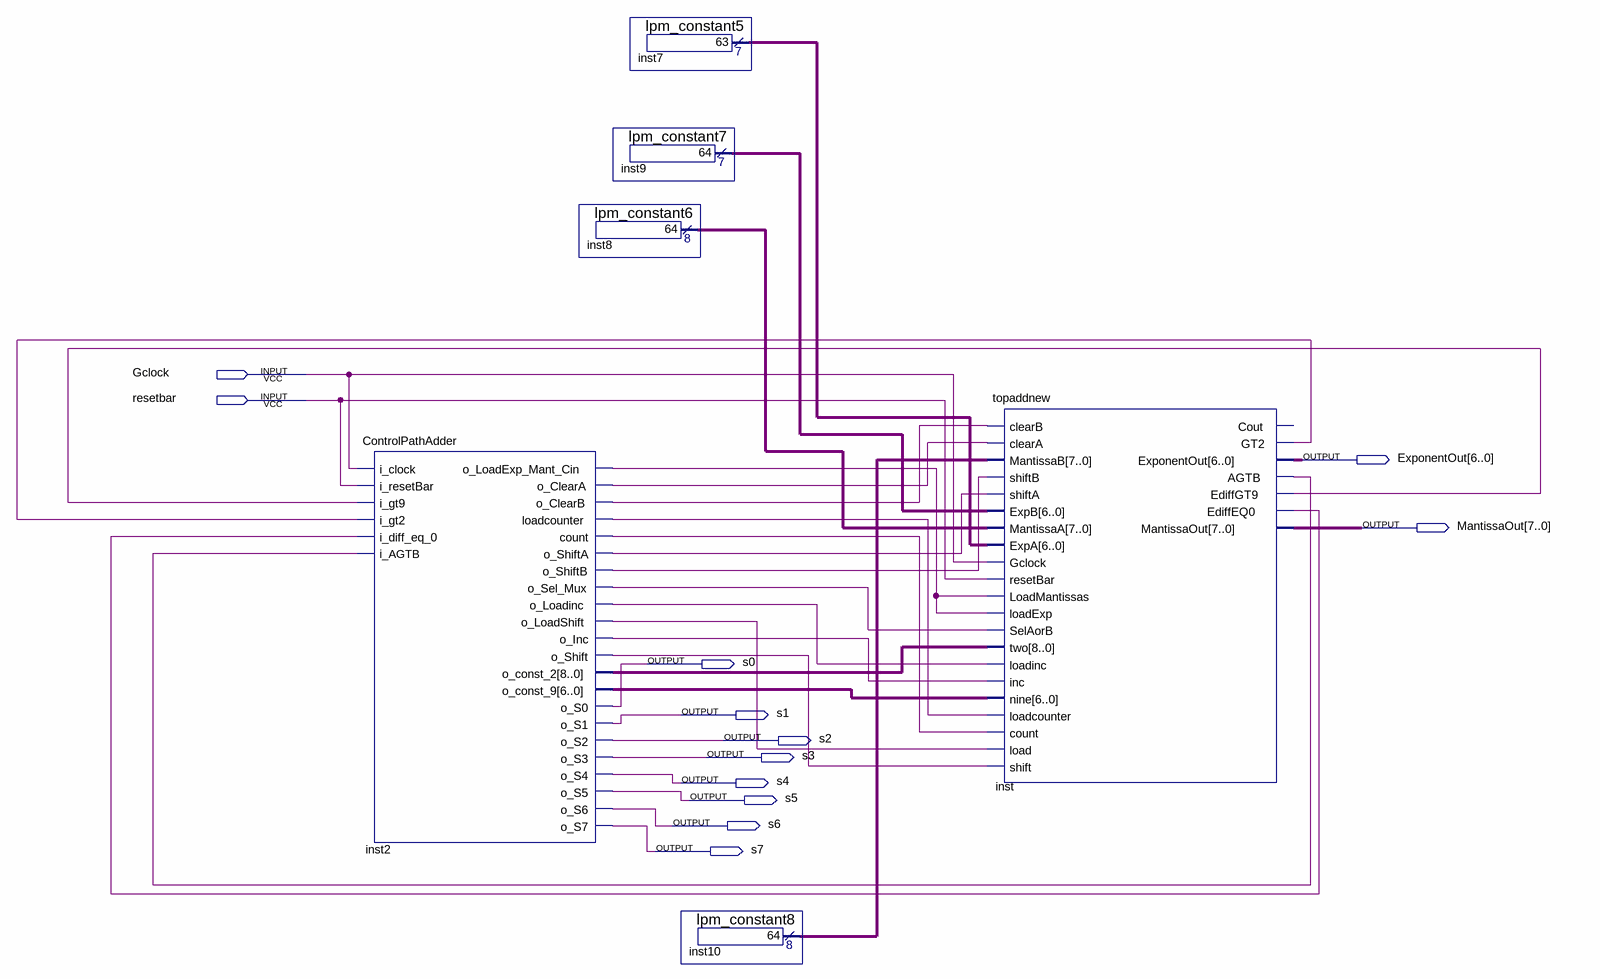
[diagram p0: schematic sheet]
// Quartus schematic adder.bdf as structural Verilog: 6 symbols, 12 pins
module adder (
  input  Gclock,
  input  resetbar,
  output [6:0] ExponentOut,
  output [7:0] MantissaOut,
  output s0,
  output s1,
  output s2,
  output s3,
  output s4,
  output s5,
  output s6,
  output s7
);

  wire inst2_count, inst2_loadcounter, inst2_o_cleara, inst2_o_clearb, inst2_o_inc, inst2_o_loadexp_mant_cin,
       inst2_o_loadinc, inst2_o_loadshift, inst2_o_sel_mux, inst2_o_shift, inst2_o_shifta, inst2_o_shiftb,
       inst_agtb, inst_ediffeq0, inst_ediffgt9, inst_gt2;
  wire [6:0] inst2_o_const_9, inst7_result, inst9_result;
  wire [7:0] inst8_result, inst10_result;
  wire [8:0] inst2_o_const_2;

  ControlPathAdder inst2 (
    .i_clock(Gclock), .i_resetBar(resetbar), .i_gt9(inst_ediffgt9), .i_gt2(inst_gt2),
    .i_diff_eq_0(inst_ediffeq0), .i_AGTB(inst_agtb), .o_LoadExp_Mant_Cin(inst2_o_loadexp_mant_cin),
    .o_ClearA(inst2_o_cleara), .o_ClearB(inst2_o_clearb), .loadcounter(inst2_loadcounter),
    .count(inst2_count), .o_ShiftA(inst2_o_shifta), .o_ShiftB(inst2_o_shiftb), .o_Sel_Mux(inst2_o_sel_mux),
    .o_Loadinc(inst2_o_loadinc), .o_LoadShift(inst2_o_loadshift), .o_Inc(inst2_o_inc),
    .o_Shift(inst2_o_shift), .o_const_2(inst2_o_const_2), .o_const_9(inst2_o_const_9), .o_S0(s0), .o_S1(s1),
    .o_S2(s2), .o_S3(s3), .o_S4(s4), .o_S5(s5), .o_S6(s6), .o_S7(s7));
  lpm_constant7 inst9 (.result(inst9_result));
  lpm_constant6 inst8 (.result(inst8_result));
  lpm_constant5 inst7 (.result(inst7_result));
  lpm_constant8 inst10 (.result(inst10_result));
  topaddnew inst (
    .clearB(inst2_o_clearb), .clearA(inst2_o_cleara), .MantissaB(inst10_result), .shiftB(inst2_o_shiftb),
    .shiftA(inst2_o_shifta), .ExpB(inst9_result), .MantissaA(inst8_result), .ExpA(inst7_result),
    .Gclock(Gclock), .resetBar(resetbar), .LoadMantissas(inst2_o_loadexp_mant_cin),
    .loadExp(inst2_o_loadexp_mant_cin), .SelAorB(inst2_o_sel_mux), .two(inst2_o_const_2),
    .loadinc(inst2_o_loadinc), .inc(inst2_o_inc), .nine(inst2_o_const_9), .loadcounter(inst2_loadcounter),
    .count(inst2_count), .load(inst2_o_loadshift), .shift(inst2_o_shift), .GT2(inst_gt2),
    .ExponentOut(ExponentOut), .AGTB(inst_agtb), .EdiffGT9(inst_ediffgt9), .EdiffEQ0(inst_ediffeq0),
    .MantissaOut(MantissaOut));  // open: Cout
endmodule
